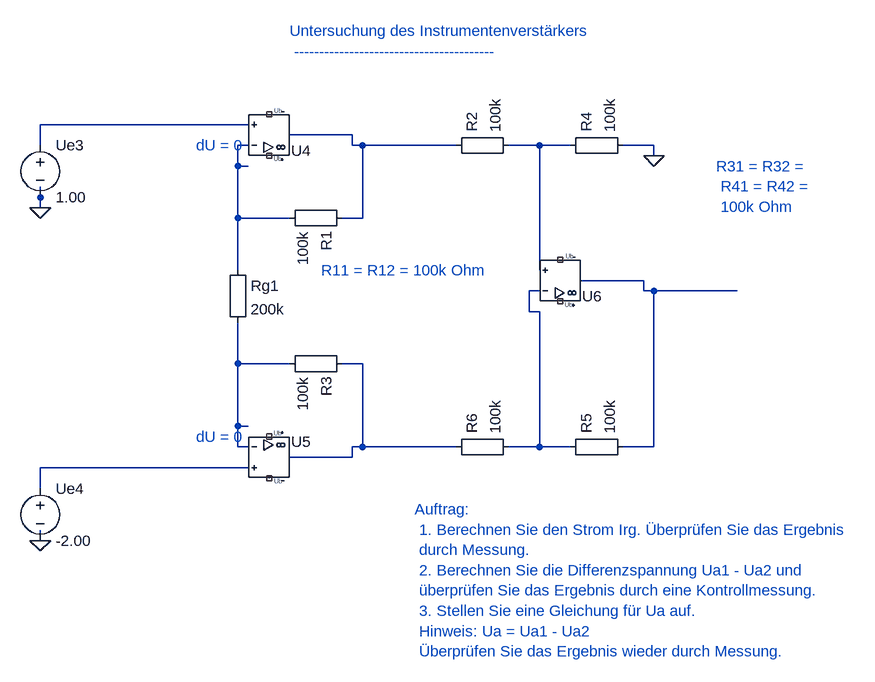
[diagram p0: schematic 1_4_1_Exkurs_Instrumentenverstaerker.asc]
1_4_1_Exkurs_Instrumentenverstaerker.asc, the LTspice schematic file:
Version 4
SHEET 1 880 680
WIRE 448 240 432 240
WIRE 432 240 432 272
WIRE 432 272 448 272
WIRE 512 224 608 224
WIRE 608 224 608 240
WIRE 448 704 432 704
WIRE 432 704 432 672
WIRE 432 672 448 672
WIRE 512 720 608 720
WIRE 608 720 608 704
WIRE 896 464 880 464
WIRE 880 464 880 496
WIRE 880 496 896 496
WIRE 960 448 1056 448
WIRE 1056 448 1056 464
WIRE 128 320 128 304
WIRE 128 848 128 832
WIRE 608 240 624 240
WIRE 624 240 768 240
WIRE 592 352 624 352
WIRE 624 352 624 240
WIRE 896 432 896 240
WIRE 896 240 848 240
WIRE 1072 256 1072 240
WIRE 1072 240 1024 240
WIRE 944 240 896 240
WIRE 608 704 624 704
WIRE 848 704 896 704
WIRE 624 704 768 704
WIRE 592 576 624 576
WIRE 624 576 624 704
WIRE 896 704 896 496
WIRE 944 704 896 704
WIRE 1024 704 1072 704
WIRE 1072 704 1072 464
WIRE 128 240 128 208
WIRE 128 208 448 208
WIRE 128 336 128 304
WIRE 448 736 128 736
WIRE 128 736 128 768
WIRE 432 272 432 352
WIRE 432 352 512 352
WIRE 432 432 432 352
WIRE 432 512 432 576
WIRE 432 576 432 672
WIRE 512 576 432 576
WIRE 1072 464 1056 464
WIRE 1200 464 1072 464
FLAG 128 336 0
FLAG 1072 256 0
FLAG 128 848 0
FLAG 128 336 0
FLAG 1072 256 0
FLAG 128 848 0
SYMBOL UniversalOpAmp2 480 224 M180
SYMATTR InstName U4
SYMATTR Value UniversalOpAmp2
SYMBOL Misc\EuropeanResistor 608 336 R90
SYMATTR InstName R1
SYMATTR Value 100k
SYMBOL Misc\EuropeanResistor 752 256 R270
SYMATTR InstName R2
SYMATTR Value 100k
SYMBOL Misc\EuropeanResistor 608 560 R90
SYMATTR InstName R3
SYMATTR Value 100k
SYMBOL UniversalOpAmp2 480 720 R0
SYMATTR InstName U5
SYMATTR Value UniversalOpAmp2
SYMBOL UniversalOpAmp2 928 448 M180
SYMATTR InstName U6
SYMATTR Value UniversalOpAmp2
SYMBOL Misc\EuropeanResistor 928 256 R270
SYMATTR InstName R4
SYMATTR Value 100k
SYMBOL Misc\EuropeanResistor 928 720 R270
SYMATTR InstName R5
SYMATTR Value 100k
SYMBOL Misc\EuropeanResistor 752 720 R270
SYMATTR InstName R6
SYMATTR Value 100k
SYMBOL voltage 128 224 R0
SYMATTR InstName Ue3
SYMATTR Value 1.00
SYMBOL voltage 128 752 R0
SYMATTR InstName Ue4
SYMATTR Value -2.00
SYMBOL Misc\EuropeanResistor 416 416 R0
SYMATTR InstName Rg1
SYMATTR Value 200k
TEXT 704 800 Left 2 ;Auftrag: \n 1. Berechnen Sie den Strom Irg. Überprüfen Sie das Ergebnis \n durch Messung. \n 2. Berechnen Sie die Differenzspannung Ua1 - Ua2 und \n überprüfen Sie das Ergebnis durch eine Kontrollmessung. \n 3. Stellen Sie eine Gleichung für Ua auf. \n Hinweis: Ua = Ua1 - Ua2 \n Überprüfen Sie das Ergebnis wieder durch Messung.
TEXT 512 64 Left 2 ;Untersuchung des Instrumentenverstärkers \n ----------------------------------------
TEXT 368 240 Left 2 ;dU = 0
TEXT 368 688 Left 2 ;dU = 0
TEXT 1168 272 Left 2 ;R31 = R32 = \n R41 = R42 = \n 100k Ohm
TEXT 560 432 Left 2 ;R11 = R12 = 100k Ohm

The netlist it stands for:
* 1_4_1_Exkurs_Instrumentenverstaerker.asc
XU4 N008 N001 NC_01 NC_02 N002 level2 UniversalOpAmp2 Avol=1Meg GBW=10Meg Slew=10Meg Ilimit=25m Rail=0 Vos=0 En=0 Enk=0 In=0 Ink=0 Rin=500Meg  ; pins In+ In- V+ V- OUT
R1 N002 N001 100k
R2 N002 N007 100k
R3 N004 N003 100k
XU5 N009 N003 NC_03 NC_04 N004 level2 UniversalOpAmp2 Avol=1Meg GBW=10Meg Slew=10Meg Ilimit=25m Rail=0 Vos=0 En=0 Enk=0 In=0 Ink=0 Rin=500Meg  ; pins In+ In- V+ V- OUT
XU6 N007 N005 NC_05 NC_06 N006 level2 UniversalOpAmp2 Avol=1Meg GBW=10Meg Slew=10Meg Ilimit=25m Rail=0 Vos=0 En=0 Enk=0 In=0 Ink=0 Rin=500Meg  ; pins In+ In- V+ V- OUT
R4 N007 0 100k
R5 N005 N006 100k
R6 N004 N005 100k
V§Ue3 N008 0 1.00
V§Ue4 N009 0 -2.00
Rg1 N001 N003 200k
* Auftrag:
*  1. Berechnen Sie den Strom Irg. Überprüfen Sie das Ergebnis
*  durch Messung.
*  2. Berechnen Sie die Differenzspannung Ua1 - Ua2 und
*  überprüfen Sie das Ergebnis durch eine Kontrollmessung.
*  3. Stellen Sie eine Gleichung für Ua auf.
*  Hinweis: Ua = Ua1 - Ua2
*  Überprüfen Sie das Ergebnis wieder durch Messung.
* Untersuchung des Instrumentenverstärkers
*  ----------------------------------------
* dU = 0
* dU = 0
* R31 = R32 =
*  R41 = R42 =
*  100k Ohm
* R11 = R12 = 100k Ohm
.lib UniversalOpAmp2.lib
.backanno
.end